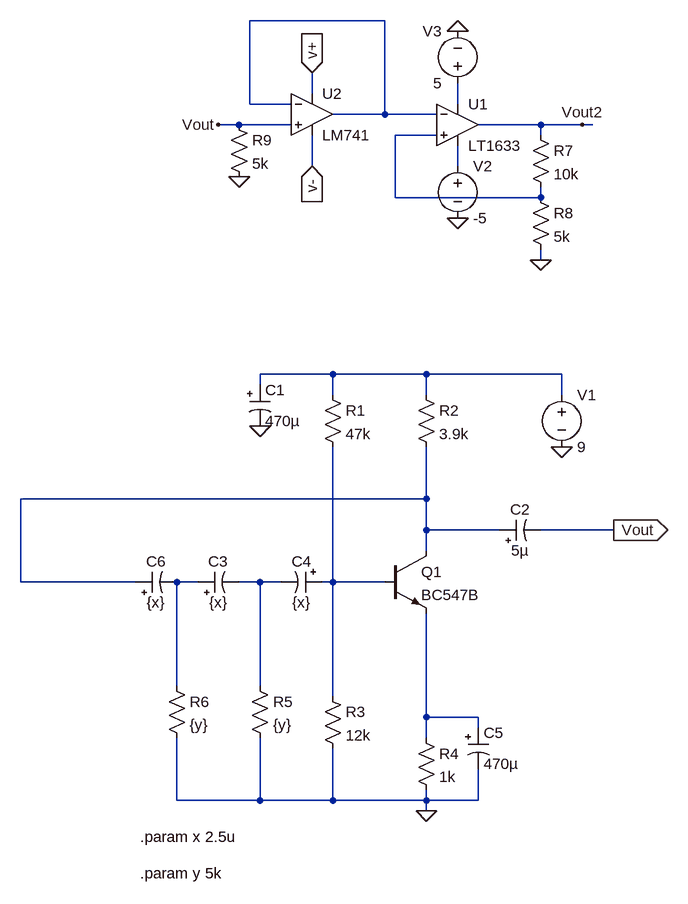
[diagram p0: schematic Draft27.asc]
Draft27.asc, the LTspice schematic file:
Version 4
SHEET 1 880 1136
WIRE 256 -192 48 -192
WIRE 144 -80 144 -112
WIRE 48 -64 48 -192
WIRE 112 -64 48 -64
WIRE 368 -64 368 -96
WIRE 256 -48 256 -192
WIRE 256 -48 176 -48
WIRE 336 -48 256 -48
WIRE 32 -32 0 -32
WIRE 112 -32 32 -32
WIRE 496 -32 400 -32
WIRE 560 -32 496 -32
WIRE 576 -32 560 -32
WIRE 336 -16 272 -16
WIRE 496 -16 496 -32
WIRE 144 32 144 -16
WIRE 368 32 368 0
WIRE 272 80 272 -16
WIRE 496 80 496 64
WIRE 496 80 272 80
WIRE 496 176 496 160
WIRE 176 352 64 352
WIRE 320 352 176 352
WIRE 528 352 320 352
WIRE 64 368 64 352
WIRE 176 384 176 352
WIRE 320 384 320 352
WIRE 528 384 528 352
WIRE 320 544 320 464
WIRE 320 544 -304 544
WIRE 320 592 320 544
WIRE 432 592 320 592
WIRE 608 592 496 592
WIRE 320 624 320 592
WIRE -304 672 -304 544
WIRE -128 672 -304 672
WIRE -32 672 -64 672
WIRE 64 672 32 672
WIRE 96 672 64 672
WIRE 176 672 176 464
WIRE 176 672 160 672
WIRE 256 672 176 672
WIRE -64 832 -64 672
WIRE 64 832 64 672
WIRE 176 848 176 672
WIRE 320 880 320 720
WIRE 400 880 320 880
WIRE 400 896 400 880
WIRE 320 912 320 880
WIRE -64 1008 -64 912
WIRE 64 1008 64 912
WIRE 64 1008 -64 1008
WIRE 176 1008 176 928
WIRE 176 1008 64 1008
WIRE 320 1008 320 992
WIRE 320 1008 176 1008
WIRE 400 1008 400 960
WIRE 400 1008 320 1008
WIRE 320 1024 320 1008
FLAG 320 1024 0
FLAG 608 592 Vout
IOPIN 608 592 Out
FLAG 528 464 0
FLAG 64 432 0
FLAG 0 -32 Vout
FLAG 496 176 0
FLAG 560 -32 Vout2
FLAG 144 32 v-
IOPIN 144 32 In
FLAG 144 -112 v+
IOPIN 144 -112 In
FLAG 32 48 0
FLAG 368 112 0
FLAG 368 -176 0
SYMBOL res 160 368 R0
SYMATTR InstName R1
SYMATTR Value 47k
SYMBOL res 304 368 R0
SYMATTR InstName R2
SYMATTR Value 3.9k
SYMBOL npn 256 624 R0
SYMATTR InstName Q1
SYMATTR Value BC547B
SYMBOL res 160 832 R0
SYMATTR InstName R3
SYMATTR Value 12k
SYMBOL res 304 896 R0
SYMATTR InstName R4
SYMATTR Value 1k
SYMBOL voltage 528 368 R0
SYMATTR InstName V1
SYMATTR Value 9
SYMBOL res 48 816 R0
SYMATTR InstName R5
SYMATTR Value {y}
SYMBOL res -80 816 R0
SYMATTR InstName R6
SYMATTR Value {y}
SYMBOL polcap 48 368 R0
SYMATTR InstName C1
SYMATTR Value 470µ
SYMBOL polcap 432 608 R270
WINDOW 0 32 32 VTop 2
WINDOW 3 0 32 VBottom 2
SYMATTR InstName C2
SYMATTR Value 5µ
SYMBOL polcap -32 688 R270
WINDOW 0 32 32 VTop 2
WINDOW 3 0 32 VBottom 2
SYMATTR InstName C3
SYMATTR Value {x}
SYMBOL polcap 160 656 R90
WINDOW 0 0 32 VBottom 2
WINDOW 3 32 32 VTop 2
SYMATTR InstName C4
SYMATTR Value {x}
SYMBOL polcap 384 896 R0
SYMATTR InstName C5
SYMATTR Value 470µ
SYMBOL polcap -128 688 R270
WINDOW 0 32 32 VTop 2
WINDOW 3 0 32 VBottom 2
SYMATTR InstName C6
SYMATTR Value {x}
SYMBOL Opamps/LT1633 368 -96 R0
SYMATTR InstName U1
SYMBOL res 480 -32 R0
SYMATTR InstName R7
SYMATTR Value 10k
SYMBOL res 480 64 R0
SYMATTR InstName R8
SYMATTR Value 5k
SYMBOL Opamps/opamp2 144 -112 R0
SYMATTR InstName U2
SYMATTR Value LM741
SYMBOL res 16 -48 R0
SYMATTR InstName R9
SYMATTR Value 5k
SYMBOL voltage 368 16 R0
SYMATTR InstName V2
SYMATTR Value -5
SYMBOL voltage 368 -80 R180
WINDOW 0 24 96 Left 2
WINDOW 3 24 16 Left 2
SYMATTR InstName V3
SYMATTR Value 5
TEXT -120 1064 Left 2 !.param x 2.5u
TEXT -120 1120 Left 2 !.param y 5k

The netlist it stands for:
* Draft27.asc
R1 N005 N009 47k
R2 N005 N006 3.9k
Q1 N006 N009 N010 0 BC547B
R3 N009 0 12k
R4 N010 0 1k
V1 N005 0 9
R5 N008 0 {y}
R6 N007 0 {y}
C1 N005 0 470µ
C2 N006 Vout 5µ
C3 N007 N008 {x}
C4 N009 N008 {x}
C5 N010 0 470µ
C6 N006 N007 {x}
XU1 N003 N001 N002 N004 Vout2 LT1633  ; pins In+ In- V+ V- OUT
R7 Vout2 N003 10k
R8 N003 0 5k
XU2 Vout N001 v+ v- N001 LM741  ; pins In+ In- V+ V- OUT
R9 Vout 0 5k
V2 N004 0 -5
V3 N002 0 5
.model NPN NPN
.model PNP PNP
.lib standard.bjt
.param x 2.5u
.param y 5k
.backanno
.end